# Altium project Vitor.PrjPCB
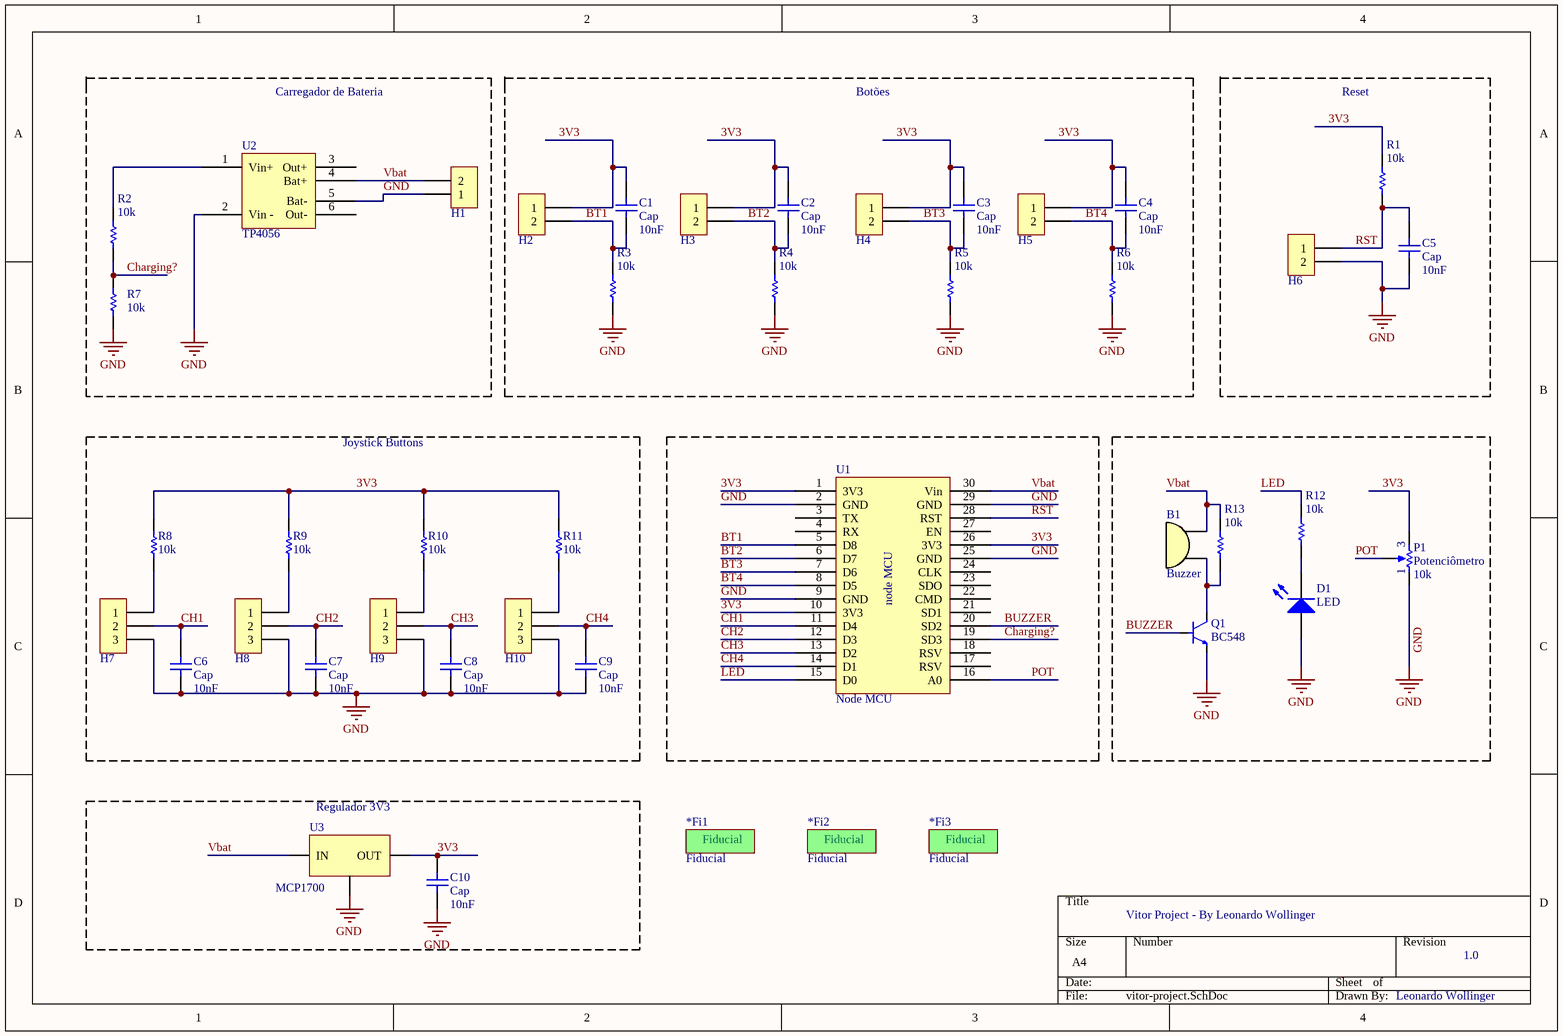
[diagram p0: vitor-project.SchDoc]
1 sheet, 43 parts. Net scope: global (net labels, ports and power ports of the same name join across sheets).
Board file: PCB-vitor-project.PcbDoc

## Sheet vitor-project.SchDoc
size A4

### Parts
*Fi1  Fiducial  [Fiducial]
*Fi2  Fiducial  [Fiducial]
*Fi3  Fiducial  [Fiducial]
B1  Buzzer  [Buzzer]
C1  Cap  Valor: 10nF  [Cap 100]
C2  Cap  Valor: 10nF  [Cap 100]
C3  Cap  Valor: 10nF  [Cap 100]
C4  Cap  Valor: 10nF  [Cap 100]
C5  Cap  Valor: 10nF  [Cap 100]
C6  Cap  Valor: 10nF  [Cap 100]
C7  Cap  Valor: 10nF  [Cap 100]
C8  Cap  Valor: 10nF  [Cap 100]
C9  Cap  Valor: 10nF  [Cap 100]
C10  Cap  Valor: 10nF  [Cap 100]
D1  LED  [LED 5mm]
H1  Header 2x1  [Header 2x1]  (value not drawn)
H2  Header 2x1  [Header 2x1]  (value not drawn)
H3  Header 2x1  [Header 2x1]  (value not drawn)
H4  Header 2x1  [Header 2x1]  (value not drawn)
H5  Header 2x1  [Header 2x1]  (value not drawn)
H6  Header 2x1  [Header 2x1]  (value not drawn)
H7  Header 3x1  [Header 3x1]  (value not drawn)
H8  Header 3x1  [Header 3x1]  (value not drawn)
H9  Header 3x1  [Header 3x1]  (value not drawn)
H10  Header 3x1  [Header 3x1]  (value not drawn)
P1  Potenciômetro  Valor: 10k  [Potenciometro Vertical]
Q1  BC548  [TO-92]
R1  Valor: 10k  [Resistor 1/4W]  (hidden comment: Resistor)
R2  Valor: 10k  [Resistor 1/4W]  (hidden comment: Resistor)
R3  Valor: 10k  [Resistor 1/4W]  (hidden comment: Resistor)
R4  Valor: 10k  [Resistor 1/4W]  (hidden comment: Resistor)
R5  Valor: 10k  [Resistor 1/4W]  (hidden comment: Resistor)
R6  Valor: 10k  [Resistor 1/4W]  (hidden comment: Resistor)
R7  Valor: 10k  [Resistor 1/4W]  (hidden comment: Resistor)
R8  Valor: 10k  [Resistor 1/4W]  (hidden comment: Resistor)
R9  Valor: 10k  [Resistor 1/4W]  (hidden comment: Resistor)
R10  Valor: 10k  [Resistor 1/4W]  (hidden comment: Resistor)
R11  Valor: 10k  [Resistor 1/4W]  (hidden comment: Resistor)
R12  Valor: 10k  [Resistor 1/4W]  (hidden comment: Resistor)
R13  Valor: 10k  [Resistor 1/4W]  (hidden comment: Resistor)
U1  Node MCU  [Node MCU]
U2  TP4056  [TP4056]
U3  MCP1700  [TO-92]

### Blocks framed on the sheet
Joystick Buttons: C6-C9 H7-H10 R8-R11
Regulador 3V3: C10 U3

### Nets
GND: C5.2 C6.2 C7.2 C8.2 C9.2 C10.2 D1.1(A) H1.1 H6.2 H7.3 H8.3 H9.3 H10.3 P1.1(A) Q1.3(E) R3.1 R4.1 R5.1 R6.1 R7.1 U1.2(GND) U1.9(GND) U1.25(GND) U1.29(GND) U2.2(Vin_-) U2.5(Bat-) U3.1(GND)
3V3: C1.1 C2.1 C3.1 C4.1 C10.1 H2.1 H3.1 H4.1 H5.1 P1.3(C) R1.2 R8.2 R9.2 R10.2 R11.2 U1.1(3V3) U1.10(3V3) U1.26(3V3) U3.3(OUT)
BT1: C1.2 H2.2 R3.2 U1.5(D8)
BT2: C2.2 H3.2 R4.2 U1.6(D7)
BT3: C3.2 H4.2 R5.2 U1.7(D6)
BT4: C4.2 H5.2 R6.2 U1.8(D5)
BUZZER: Q1.2(B) U1.20(SD2)
CH1: C6.1 H7.2 U1.11(D4)
CH2: C7.1 H8.2 U1.12(D3)
CH3: C8.1 H9.2 U1.13(D2)
CH4: C9.1 H10.2 U1.14(D1)
Charging?: R2.1 R7.2 U1.19(SD3)
LED: R12.2 U1.15(D0)
POT: P1.2(B) U1.16(A0)
RST: C5.1 H6.1 R1.1 U1.28(RST)
Vbat: B1.2(-) H1.2 R13.2 U1.30(Vin) U2.4(Bat+) U3.2(IN)
NetB1_1: B1.1(+) Q1.1(C) R13.1
NetD1_2: D1.2(K) R12.1
NetH7_1: H7.1 R8.1
NetH8_1: H8.1 R9.1
NetH9_1: H9.1 R10.1
NetH10_1: H10.1 R11.1
NetR2_2: R2.2 U2.1(Vin+)

Not connected (* = marked no-connect by the designer): U1 3(TX) 4(RX) 17(RSV) 18(RSV) 21(SD1) 22(CMD) 23(SDO) 24(CLK) 27(EN); U2 3(Out+) 6(Out-)

### Notes on the sheet
- Carregador de Bateria
- Botões
- Reset
- Vitor Project - By Leonardo Wollinger
- 1.0
- Leonardo Wollinger
- (in symbol Node MCU) node MCU

### Library data of the parts
*Fi1-*Fi3 = Fiducial: Fiduciais para montagem em pick n' place
P1 = Potenciômetro: Tipo: Linear
Q1 = BC548: Transistor NPN
U3 = MCP1700: LDO Voltage Regulator